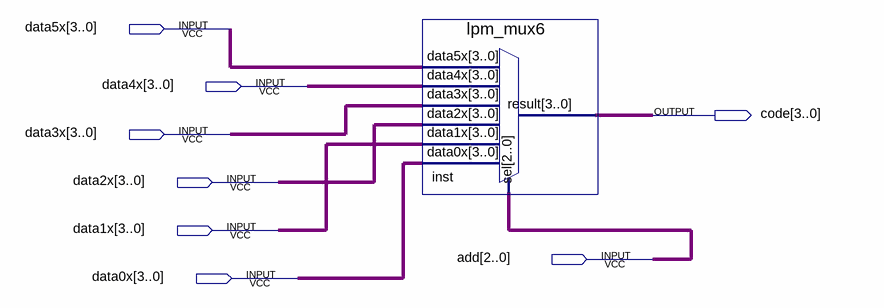
[diagram p0: schematic sheet]
// Quartus schematic code_select.bdf as structural Verilog: 1 symbols, 8 pins
module code_select (
  input  [3:0] data5x,
  input  [3:0] data4x,
  input  [3:0] data3x,
  input  [3:0] data2x,
  input  [3:0] data1x,
  input  [2:0] add,
  input  [3:0] data0x,
  output [3:0] code
);

  lpm_mux6 inst (
    .data5x(data5x), .data4x(data4x), .data3x(data3x), .data2x(data2x), .data1x(data1x), .data0x(data0x),
    .sel(add), .result(code));
endmodule
